# Altium schematic sheet Interface.SchDoc: =AM_Title
size A3; CompanyName: Antmicro Ltd; Address1: Zwierzyniecka 3; Address2: 60-813 Poznań; Address3: Poland; Address4: 60-813 Poznań, Poland; SheetNumber: 1; SheetTotal: 1; PageSetup: Record=PageOptions|CenterHorizontal=True|CenterVertical=True|PrintScale=0.97|XCorrection=1.00|YCorrection=1.00|PrintKind=1|BorderSize=5000000|LeftOffset=0|BottomOffset=0|Orientation=2|PaperLength=2970|PaperWidth=2100|Scale=100|PaperSource=7|PrintQuality=600|MediaType=1|DitherType=10|PaperKind=A4|PrintScaleMode=1
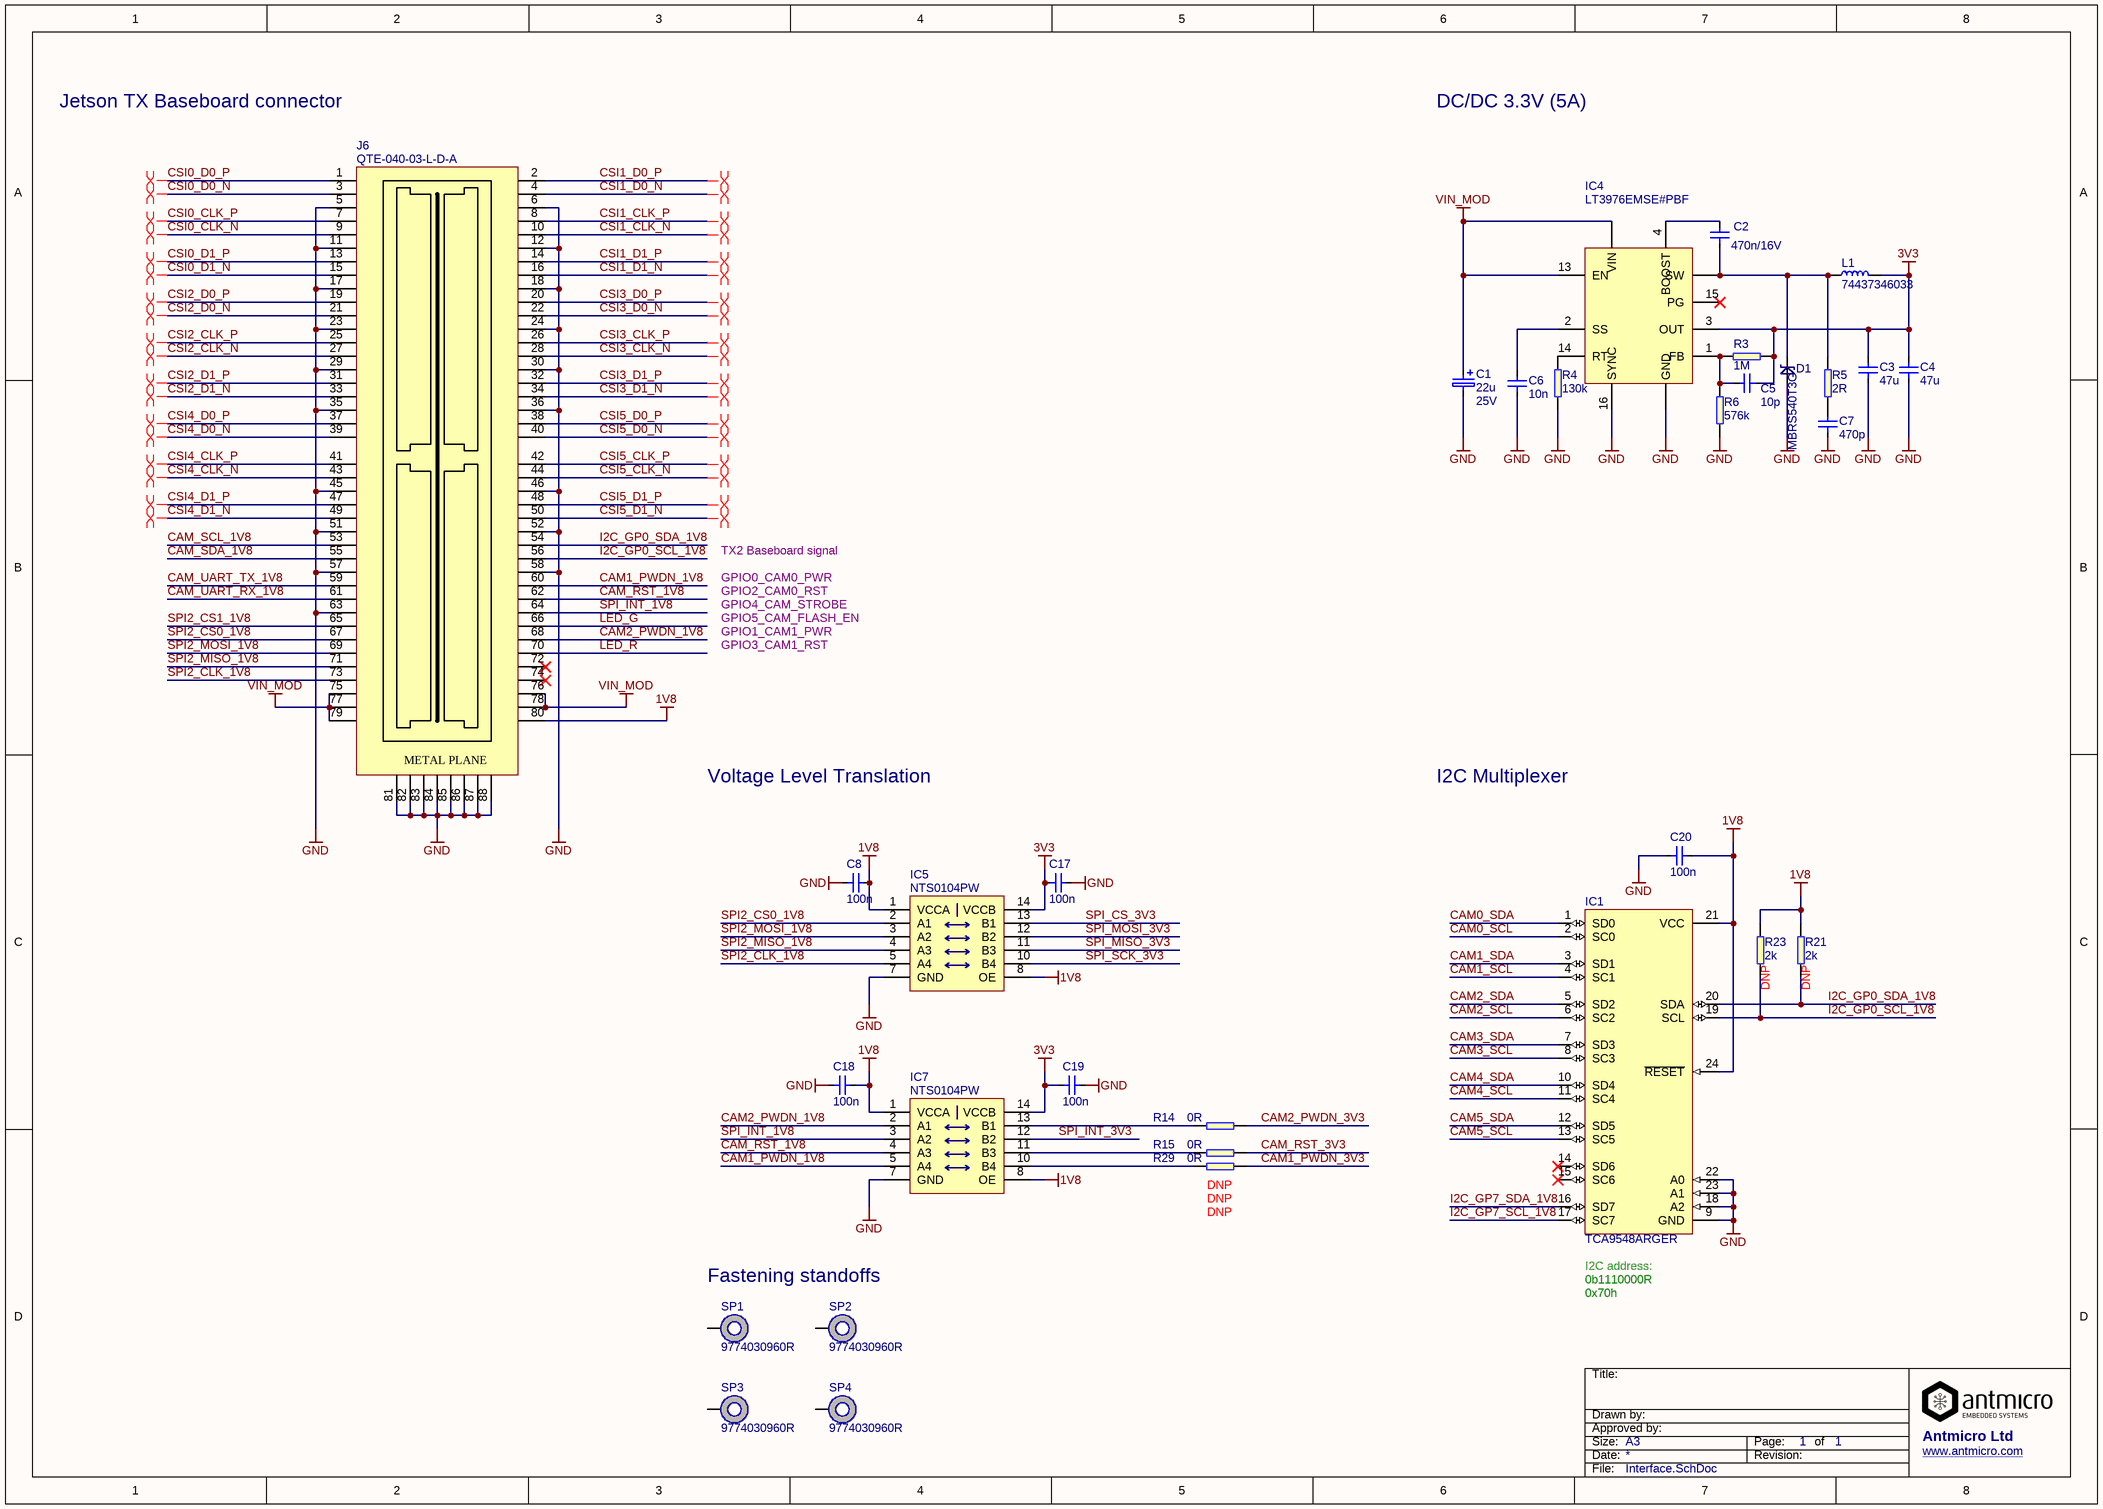
[diagram p0: Interface.SchDoc]

## Parts
C1  Voltage: 25V  [KEMET_C]  (hidden comment: 22u)
C2  470n/16V  [0402]
C3  47u  [1206]
C4  47u  [1206]
C5  10p  [0402]
C6  10n  [0402]
C7  470p  [0402]
C8  100n  [0402]
C17  100n  [0402]
C18  100n  [0402]
C19  100n  [0402]
C20  100n  [0402]
D1  MBRS540T3G  [SMC-403-03]
IC1  TCA9548ARGER  [VQFN-24]
IC4  LT3976EMSE#PBF  [LT3976EMSE]
IC5  NTS0104PW  [TSSOP-14]
IC7  NTS0104PW  [TSSOP-14]
J6  QTE-040-03-L-D-A  [QTE-040-03-L-D-A]
L1  74437346033  [WE-LHMI]
R3  1M  [0603]
R4  130k  [0402]
R5  2R  [0402]
R6  576k  [0402]
R14  0R  [0402]
R15  0R  [0402]
R21  2k  [0603]
R23  2k  [0603]
R29  0R  [0402]
SP1  9774030960R  [9774030960]
SP2  9774030960R  [9774030960]
SP3  9774030960R  [9774030960]
SP4  9774030960R  [9774030960]

## Nets
1V8: C8.2 C18.2 C20.2 IC1.21(VCC) IC1.24(~{RESET}) IC5.1(VCCA) IC5.8(OE) IC7.1(VCCA) IC7.8(OE) J6.80 R21.1 R23.1
3V3: C3.2 C4.2 C5.1 C17.1 C19.1 IC4.3(OUT) IC5.14(VCCB) IC7.14(VCCB) L1.2 R3.1
GND: C1.2 C3.1 C4.1 C6.1 C7.1 C8.1 C17.2 C18.1 C19.2 C20.1 D1.A IC1.9(GND) IC1.18(A2) IC1.22(A0) IC1.23(A1) IC4.16(SYNC) IC4.GND IC5.7(GND) IC7.7(GND) J6.5 J6.6 J6.11 J6.12 J6.17 J6.18 J6.23 J6.24 J6.29 J6.30 J6.35 J6.36 J6.45 J6.46 J6.51 J6.52 J6.57 J6.58 J6.63 J6.81 J6.82 J6.83 J6.84 J6.85 J6.86 J6.87 J6.88 R4.1 R6.1
VIN_MOD: C1.1 IC4.13(EN) IC4.VIN J6.75 J6.76 J6.77 J6.78 J6.79
CAM0_SCL: IC1.2(SC0)
CAM0_SDA: IC1.1(SD0)
CAM1_PWDN_1V8: IC7.5(A4) J6.60
CAM1_PWDN_3V3: R29.2
CAM1_SCL: IC1.4(SC1)
CAM1_SDA: IC1.3(SD1)
CAM2_PWDN_1V8: IC7.2(A1) J6.68
CAM2_PWDN_3V3: R14.2
CAM2_SCL: IC1.6(SC2)
CAM2_SDA: IC1.5(SD2)
CAM3_SCL: IC1.8(SC3)
CAM3_SDA: IC1.7(SD3)
CAM4_SCL: IC1.11(SC4)
CAM4_SDA: IC1.10(SD4)
CAM5_SCL: IC1.13(SC5)
CAM5_SDA: IC1.12(SD5)
CAM_RST_1V8: IC7.4(A3) J6.62
CAM_RST_3V3: R15.2
CAM_SCL_1V8: J6.53
CAM_SDA_1V8: J6.55
CAM_UART_RX_1V8: J6.61
CAM_UART_TX_1V8: J6.59
CSI0_CLK_N: J6.9
CSI0_CLK_P: J6.7
CSI0_D0_N: J6.3
CSI0_D0_P: J6.1
CSI0_D1_N: J6.15
CSI0_D1_P: J6.13
CSI1_CLK_N: J6.10
CSI1_CLK_P: J6.8
CSI1_D0_N: J6.4
CSI1_D0_P: J6.2
CSI1_D1_N: J6.16
CSI1_D1_P: J6.14
CSI2_CLK_N: J6.27
CSI2_CLK_P: J6.25
CSI2_D0_N: J6.21
CSI2_D0_P: J6.19
CSI2_D1_N: J6.33
CSI2_D1_P: J6.31
CSI3_CLK_N: J6.28
CSI3_CLK_P: J6.26
CSI3_D0_N: J6.22
CSI3_D0_P: J6.20
CSI3_D1_N: J6.34
CSI3_D1_P: J6.32
CSI4_CLK_N: J6.43
CSI4_CLK_P: J6.41
CSI4_D0_N: J6.39
CSI4_D0_P: J6.37
CSI4_D1_N: J6.49
CSI4_D1_P: J6.47
CSI5_CLK_N: J6.44
CSI5_CLK_P: J6.42
CSI5_D0_N: J6.40
CSI5_D0_P: J6.38
CSI5_D1_N: J6.50
CSI5_D1_P: J6.48
I2C_GP0_SCL_1V8: IC1.19(SCL) J6.56 R23.2
I2C_GP0_SDA_1V8: IC1.20(SDA) J6.54 R21.2
I2C_GP7_SCL_1V8: IC1.17(SC7)
I2C_GP7_SDA_1V8: IC1.16(SD7)
LED_G: J6.66
LED_R: J6.70
SPI2_CLK_1V8: IC5.5(A4) J6.73
SPI2_CS0_1V8: IC5.2(A1) J6.67
SPI2_CS1_1V8: J6.65
SPI2_MISO_1V8: IC5.4(A3) J6.71
SPI2_MOSI_1V8: IC5.3(A2) J6.69
SPI_CS_3V3: IC5.13(B1)
SPI_INT_1V8: IC7.3(A2) J6.64
SPI_INT_3V3: IC7.12(B2)
SPI_MISO_3V3: IC5.11(B3)
SPI_MOSI_3V3: IC5.12(B2)
SPI_SCK_3V3: IC5.10(B4)
NetC2_1: C2.1 D1.C IC4.SW L1.1 R5.2
NetC2_2: C2.2 IC4.4(BOOST)
NetC5_2: C5.2 IC4.1(FB) R3.2 R6.2
NetC6_2: C6.2 IC4.2(SS)
NetC7_2: C7.2 R5.1
NetIC4_14: IC4.14(RT) R4.2
NetIC7_10: IC7.10(B4) R29.1
NetIC7_11: IC7.11(B3) R15.1
NetIC7_13: IC7.13(B1) R14.1

Not connected (* = marked no-connect by the designer): IC1 14(SD6)* 15(SC6)*; IC4 15(PG)*; J6 72* 74*; SP1 1; SP2 1; SP3 1; SP4 1

## Layout directives
differential pair: CSI0_CLK_N, CSI0_CLK_P, CSI0_D0_N, CSI0_D0_P, CSI0_D1_N, CSI0_D1_P, CSI1_CLK_N, CSI1_CLK_P, CSI1_D0_N, CSI1_D0_P, CSI1_D1_N, CSI1_D1_P, CSI2_CLK_N, CSI2_CLK_P, CSI2_D0_N, CSI2_D0_P, CSI2_D1_N, CSI2_D1_P, CSI3_CLK_N, CSI3_CLK_P, CSI3_D0_N, CSI3_D0_P, CSI3_D1_N, CSI3_D1_P, CSI4_CLK_N, CSI4_CLK_P, CSI4_D0_N, CSI4_D0_P, CSI4_D1_N, CSI4_D1_P, CSI5_CLK_N, CSI5_CLK_P, CSI5_D0_N, CSI5_D0_P, CSI5_D1_N, CSI5_D1_P

## Notes on the sheet
- Jetson TX Baseboard connector
- DC/DC 3.3V (5A)
- GPIO0_CAM0_PWR
- TX2 Baseboard signal
- GPIO2_CAM0_RST
- GPIO4_CAM_STROBE
- GPIO5_CAM_FLASH_EN
- GPIO1_CAM1_PWR
- GPIO3_CAM1_RST
- Voltage Level Translation
- I2C Multiplexer
- (near R23) DNP
- (near R21) DNP
- (near R29) DNP
- DNP
- Fastening standoffs
- 0x70h
- 0b1110000R
- (near IC1) I2C address:
- Title:
- Drawn by:
- Size:
- Date:
- Approved by:
- A3
- Revision:
- Page:
- of
- www.antmicro.com
- File:
- (in symbol QTE-040-03-L-D-A) METAL PLANE

## Library data of the parts
C1 = C_22u_KEMET_C: Tantalum SMT Capacitor 22uF Case KEMET_C; Manufacturer: KEMET; Part Symbol: T491C226K025AT; Value: 22u; Part Number: C_22u_KEMET_C; Supplier 1: Farnell; Supplier Part Number 1: 2283579
C2 = C_470n_0402_16V: MLCC SMT Capacitor 470nF 0402 16V; Manufacturer: TDK; Part Symbol: C1005X5R1C474K050BC; Value: 470n/16V; Part Number: C_470n_0402_16V; Supplier 1: Farnell; Supplier Part Number 1: 2346883
C3 C4 = C_47u_1206: MLCC SMT Capacitor 47uF 1206; Manufacturer: MURATA; Part Symbol: GRM31CC80J476KE18L; Value: 47u; Part Number: C_47u_1206; Supplier 1: Farnell; Supplier Part Number 1: 2218907
C5 = C_10p_0402: MLCC SMT Capacitor 10pF 0402; Manufacturer: MULTICOMP; Part Symbol: MC0402N100D500CT; Value: 10p; Part Number: C_10p_0402; Supplier 1: Farnell; Supplier Part Number 1: 1758941
C6 = C_10n_0402: MLCC SMT Capacitor 10nF 0402; Manufacturer: AVX; Part Symbol: 04025G103ZAT2A; Value: 10n; Part Number: C_10n_0402; Supplier 1: Farnell; Supplier Part Number 1: 2332531
C7 = C_470p_0402: MLCC SMT Capacitor 470pF 0402; Manufacturer: MULTICOMP; Part Symbol: MC0402B471J500CT; Value: 470p; Part Number: C_470p_0402; Supplier 1: Farnell; Supplier Part Number 1: 2320771
C8 C17-C20 = C_100n_0402: MLCC SMT Capacitor 100nF 0402; Manufacturer: MULTICOMP; Part Symbol: MC0402X104M100CT; Part Number: C_100n_0402; Value: 100n; Supplier 1: Farnell; Supplier Part Number 1: 2309011
D1 = MBRS540T3G: ON SEMICONDUCTOR  MBRS540T3G  Rectifier Diode, Single, 40 V, 5 A, 500 mV, 190 A; Part Number: MBRS540T3G; Value: MBRS540T3G; Supplier 1: Farnell; Supplier Part Number 1: 2101838; Manufacturer: ON SEMICONDUCTOR; Part Symbol: MBRS540T3G
IC1 = TCA9548ARGER: TCA9548ARGER  I2C SWITCH W/ RESET, 8-CH, VQFN-24; Manufacturer: TEXAS INSTRUMENTS; Part Number: TCA9548ARGER; Value: TCA9548ARGER; Supplier 1: Farnell; Supplier Part Number 1: 2496588; Part Symbol: TCA9548ARGER
IC4 = LT3976EMSE#PBF: LINEAR TECHNOLOGY  LT3976EMSE#PBF  DC-DC CONVERTER, 2MHZ, 5A, MSOP-16; Part Number: LT3976EMSE#PBF; Value: LT3976EMSE#PBF; Supplier 1: Farnell; Supplier Part Number 1: 2215131; Manufacturer: LINEAR TECHNOLOGY; Part Symbol: LT3976EMSE#PBF; ClassName: 12V0 Converter
IC5 IC7 = NTS0104PW: 4 bit voltage level translator; Manufacturer: NXP; Part Number: NTS0104PW; Value: NTS0104PW; Supplier 1: Farnell; Supplier Part Number 1: 2164815; Part Symbol: NTS0104PW
J6 = QTE-040-03-L-D-A: SAMTEC  QTE-040-03-L-D-A  Stacking Board Connector, Dual Row, QTE Series, 80 Contacts, Header, 0.8 mm, Surface Mount; Part Number: QTE-040-03-L-D-A; Supplier Part Number 1: 1667888; Value: QTE-040-03-L-D-A; Supplier 1: Farnell; Manufacturer: SAMTEC; Part Symbol: QTE-040-03-L-D-A
L1 = Wurth-74437346033: 3.3 uH, 5.0A, 0.03 ohm, SMD Power Inductor; Manufacturer: WURTH ELEKTRONIK; Part Number: Wurth-74437346033; Value: 74437346033; Supplier 1: Farnell; Supplier Part Number 1: 2077789; Part Symbol: 74437346033
R3 = R_1M_0603_0.1%: SMT Resistor 1M 0603 0.1%; Manufacturer: TE; Part Symbol: CPF0603B1M0E; Value: 1M; Part Number: R_1M_0603_0.1%; Tolerance: 0.1%; Supplier 1: Mouser; Supplier Part Number 1: 279-CPF0603B1M0E
R4 = R_130k_0402: SMT Resistor 2R 0402; Manufacturer: MULTICOMP; Part Symbol: MCMR04X1303FTL; Tolerance: 1%; Value: 130k; Part Number: R_130k_0402; Supplier 1: Farnell; Supplier Part Number 1: 2072607
R5 = R_2R_0402: SMT Resistor 2R 0402; Manufacturer: MULTICOMP; Part Symbol: MC00625W040212R0; Tolerance: 1%; Value: 2R; Part Number: R_2R_0402; Supplier 1: Farnell; Supplier Part Number 1: 2141424
R6 = R_576k_0805_0.1%: SMT Resistor 576k 0805 0.1%; Manufacturer: PANASONIC ELECTRONIC COMPONENTS; Part Symbol: ERA-6AEB5763V; Value: 576k; Part Number: R_576k_0805_0.1%; Tolerance: 0.1%; Supplier 1: Mouser; Supplier Part Number 1: 667-ERA-6AEB5763V
R14 R15 R29 = R_0R_0402: SMT Resistor 0402; Manufacturer: MULTICOMP; Part Symbol: MCMR04X000 PTL; Part Number: R_0R_0402; Value: 0R; Supplier 1: Farnell; Supplier Part Number 1: 2072513
R21 R23 = R_2k_0603: SMT Resistor 2k 0603; Manufacturer: MULTICOMP; Part Symbol: MCMR06X2001FTL; Value: 2k; Part Number: R_2k_0603; Supplier 1: Farnell; Supplier Part Number 1: 2073418
SP1-SP4 = 9774030960: ROUND SPACER STEEL 3MM unthreaded; Manufacturer: WURTH ELEKTRONIK; Value: 9774030960R; Part Symbol: 9774030960